# Altium schematic sheet MSW_V4_LienDong.SchDoc
size A
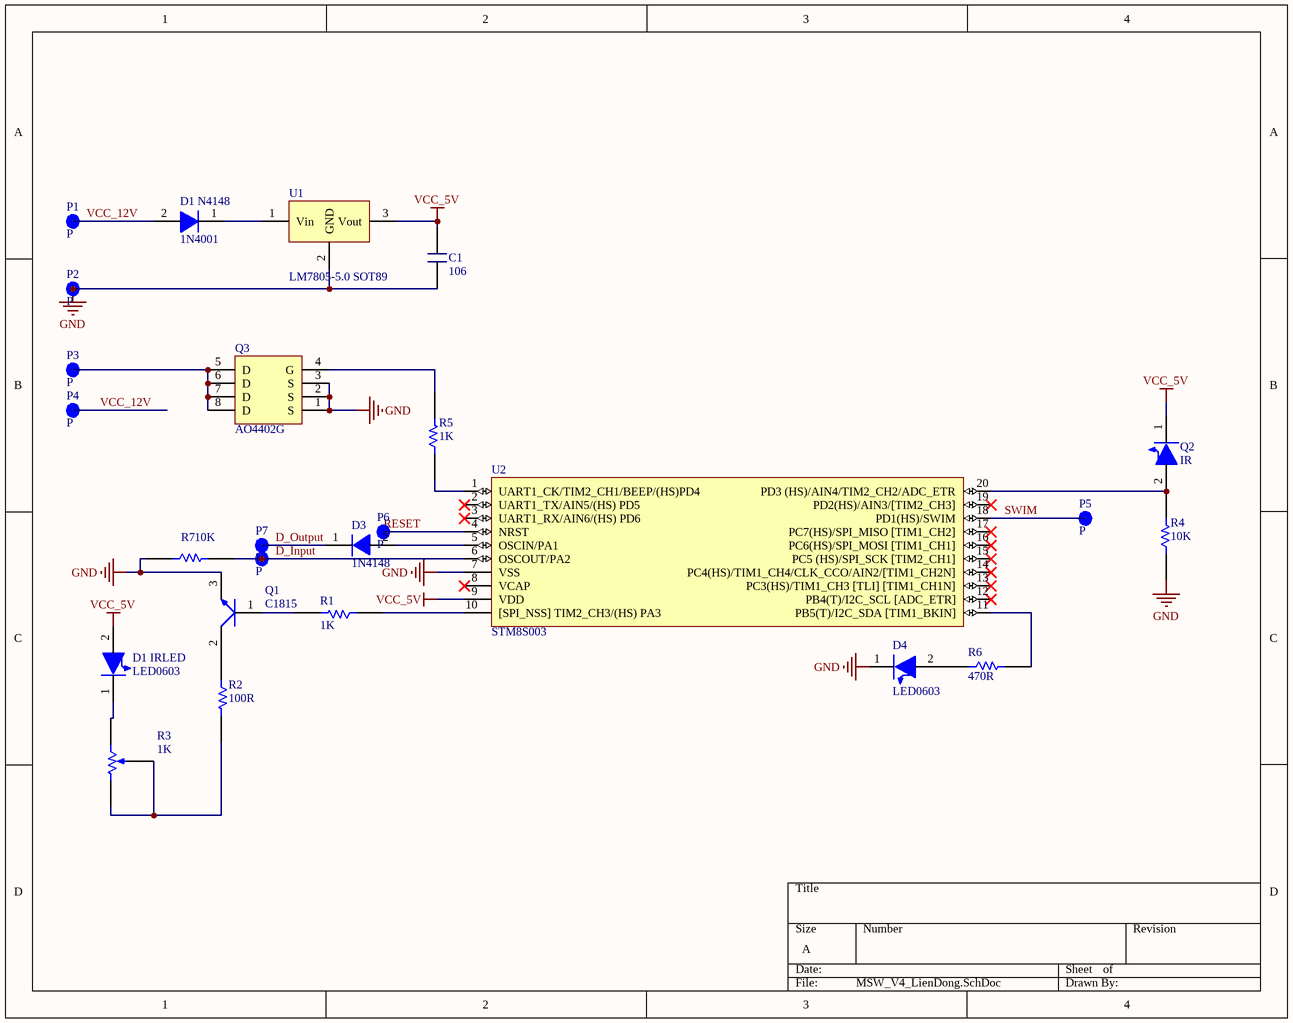
[diagram p0: MSW_V4_LienDong.SchDoc]

## Parts
C1  106
D1_IRLED  LED0603  [DIOC1608X06N]
D1_N4148  1N4001  [SODFL504X244-2N]
D3  1N4148  [DIOMELF3515N]
D4  LED0603  [DIOC1608X06N]
P1  P
P2  P
P3  P
P4  P
P5  P
P6  P
P7  P
P8  P
Q1  C1815  [SOT95P278X125-3N]
Q2  IR  [DIOC1608X06N]
Q3  AO4402G
R1  1K  [RESC2608X06N_0603]
R2  100R  [RESC2608X06N_0603]
R3  1K  [Var_SMD_3x3]
R4  10K  [RESC2608X06N_0603]
R5  1K  [RESC2608X06N_0603]
R6  470R  [RESC2608X06N_0603]
R7  10K  [RESC2608X06N_0603]
U1  LM7805-5.0 SOT89  [SOT89-150P409X160-3N]
U2  STM8S003  [TSOP65P640X120-20N]

## Nets
GND: C1.1 P2.1 Q1.3(E) Q3.1(S) Q3.2(S) Q3.3(S) R4.1 R7.1 U1.2(GND) U2.7(VSS)
VCC_5V: C1.2 D1_IRLED.2(C) Q2.1(A) U1.3(Vout) U2.9(VDD)
D_Input: P8.1 R7.2 U2.6(OSCOUT/PA2)
D_Output: D3.1(C) P7.1
RESET: P6.1 U2.4(NRST)
SWIM: P5.1 U2.18(PD1(HS)/SWIM)
VCC_12V: D1_N4148.2(A) P1.1 P4.1
NetD1_IRLED_1: D1_IRLED.1(A) R3.1
NetD1_N4148_1: D1_N4148.1(C) U1.1(Vin)
NetD3_2: D3.2(A) U2.5(OSCIN/PA1)
NetD4_2: D4.2(C) R6.1
NetP3_1: P3.1 Q3.5(D) Q3.6(D) Q3.7(D) Q3.8(D)
NetQ1_1: Q1.1(B) R1.2
NetQ1_2: Q1.2(C) R2.1
NetQ2_2: Q2.2(C) R4.2 U2.20(PD3_(HS)/AIN4/TIM2_CH2/ADC_ETR)
NetQ3_4: Q3.4(G) R5.2
NetR1_1: R1.1 U2.10([SPI_NSS]_TIM2_CH3/(HS)_PA3)
NetR2_2: R2.2 R3.2 R3.3
NetR5_1: R5.1 U2.1(UART1_CK/TIM2_CH1/BEEP/(HS)PD4)
NetR6_2: R6.2 U2.11(PB5(T)/I2C_SDA_[TIM1_BKIN])

Not connected (* = marked no-connect by the designer): D4 1(A); U2 2(UART1_TX/AIN5/(HS)_PD5)* 3(UART1_RX/AIN6/(HS)_PD6)* 8(VCAP)* 12(PB4(T)/I2C_SCL_[ADC_ETR])* 13(PC3(HS)/TIM1_CH3_[TLI]_[TIM1_CH1N])* 14(PC4(HS)/TIM1_CH4/CLK_CCO/AIN2/[TIM1_CH2N])* 15(PC5_(HS)/SPI_SCK_[TIM2_CH1])* 16(PC6(HS)/SPI_MOSI_[TIM1_CH1])* 17(PC7(HS)/SPI_MISO_[TIM1_CH2])* 19(PD2(HS)/AIN3/[TIM2_CH3])*

## Notes on the sheet
- Labels drawn without touching a wire or pin: GND

## Library data of the parts
C1 = Capacitor 106
D1_N4148 = 1N4007_SMD Diode: 1N4007_SMD
D3 = 1N4148_SMD: DIODE GEN PURP 75V 200MA DO213AA; Supplier 1: Digi-Key; Supplier Part Number 1: 1N4148UR-1-ND
P1-P8 = Point
Q1 = Transitor C1815 NPN: SOT-23 Plastic-Encapsulate Transistors
Q2 = LED0603
Q3 = AO4402G: 20V N-Channel MOSFET
R1 R5 = 1k_0603_5%: Thick Film Resistors - SMD 0603 1kOHMS 5% 1/10WATT; Supplier 1: Digi-Key; Supplier Part Number 1: CR0603-JW-101ELFCT-ND
R2 = R100_0603_5%: Thick Film Resistors - SMD 0603 100OHMS 5% 1/10WATT; Supplier 1: Digi-Key; Supplier Part Number 1: CR0603-JW-101ELFCT-ND
R3 = Varistor 3x3 SMD 1KOhm: Varistor 3x3 SMD 1KOhm 5% 1/10WATT; Supplier 1: Digi-Key; Supplier Part Number 1: CR0603-JW-101ELFCT-ND
R4 R7 = R10k_0603_5%: RES SMD 10K OHM 1% 1/4W 0603; Supplier 1: Digi-Key; Supplier Part Number 1: 541-10.0KSCT-ND
R6 = R470_0603_5%: Thick Film Resistors - SMD 470 ohm 5%; Supplier 1: Digi-Key; Supplier Part Number 1: CR0603-JW-471ELFCT-ND
U1 = LM7805 SOT89
U2 = STM8S003: MCU 8-bit STM8S STM8 CISC 8KB Flash 3.3V/5V 20-Pin TSSOP T/R; Value: STM8S003F3; Supplier Part Number 1: 497-18051-1-ND